# Altium schematic sheet Power_Supply.SchDoc (part 2 of 2)
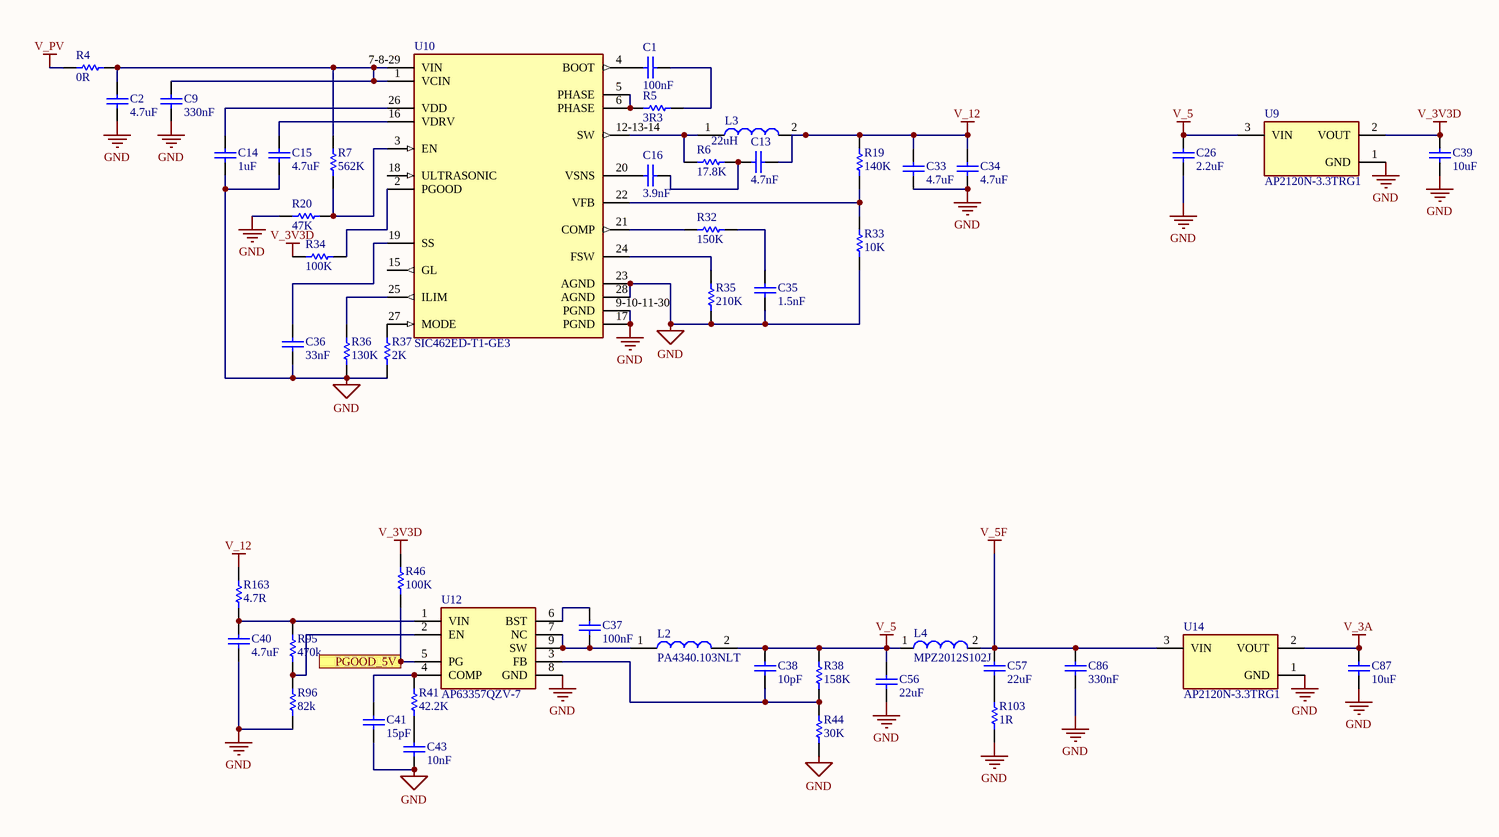
[diagram p1: Power_Supply.SchDoc]

## Library data of the parts (continued)
R20 = CMP-2000-00523-2: Chip Resistor, 47 KOhm, +/- 1%, 0.1 W, -55 to 155 degC, 0603 (1608 Metric), RoHS, Tape and Reel; Manufacturer: Panasonic; Manufacturer Part Number: ERJ3EKF4702V; Case\Package: 0603; Forward Current: 20 mA; Power Rating: 90 mW; Illumination Colour: Red; Nominal Vf: 2.1 V; Viewing Angle: 160 degrees; Luminous Intensity: 63 mcd; Lens Style: Clear; Nominal Wavelength: 639 nm; Resistance: 47kR; Max Power Dissipation: 100mW; Voltage Rating: 75V; Temperature Coefficient: 100ppm/°C; Working Voltage: 6V; Case Code (Imperial): 0603; Case Code (Metric): 1608; Packaging: Tape and Reel; Radiation Hardening: No; Colour: Red; PackageDescription: 2-Pin Surface Mount Device, Body 1.6 x 0.85 mm; ComponentLink1Description: Manufacturer URL; Width: 0.8 mm; DatasheetVersion: Apr-15; ComponentLink2URL: http://industrial.panasonic.com/cdbs/www-data/pdf/RDA0000/AOA0000C86.pdf; Min Operating Temperature: -40 degC; Height: 0.6 mm; Package Quantity: 3000; ComponentLink2Description: Datasheet; REACH SVHC: No SVHC; ComponentLink1URL: http://www.panasonic.com/; Mount: Surface Mount; RoHSCompliant: true; Max Operating Temperature: 100 degC; PackageReference: 0603; Length: 1.6 mm; Forward Voltage: 2.1 V; Pins: 2; Supplier 1: RSComponents; Supplier Part Number 1: 1755768; RoHS: Yes; Category: Chip SMD Resistors; Stock 1: 498000; Pricing 1: 5000=0.00700 (USD); Case/Package: 0603; Number of Pins: 2; Contact Plating: Tin; Tolerance: 1%; Termination: SMD/SMT; Resistor Type: Thick Film; Series: ERJ; Number of Terminations: 2; Resistance Tolerance: 1%; Voltage Rating (DC): 75V; Features: Automotive AEC-Q200; Construction: Rectangular; Technology: THICK FILM; Depth: 0.8mm; RoHS Compliant: Yes; Military Standard: Not; Lead Free: Lead Free; ComponentLink3URL: https://datasheet.ciiva.com/6138/aoa0000ce2-6138149.pdf?src-supplier=Farnell; ComponentLink3Description: https://datasheet.ciiva.com/6138/aoa0000ce2-6138149.pdf?src-supplier=Farnell; ComponentLink4URL: https://datasheet.ciiva.com/7802/aoa0000ce2-7802421.pdf?src-supplier=Element14; ComponentLink4Description: https://datasheet.ciiva.com/7802/aoa0000ce2-7802421.pdf?src-supplier=Element14; ComponentLink5URL: https://datasheet.ciiva.com/48531/aoa0000ce2-48531029.pdf?src-supplier=Avnet; ComponentLink5Description: https://datasheet.ciiva.com/48531/aoa0000ce2-48531029.pdf?src-supplier=Avnet; ComponentLink6URL: https://datasheet.ciiva.com/16514/aoa0000ce2-16514071.pdf?src-supplier=Avnet+Asia; ComponentLink6Description: https://datasheet.ciiva.com/16514/aoa0000ce2-16514071.pdf?src-supplier=Avnet+Asia; ComponentLink7URL: https://datasheet.ciiva.com/46398/1678782-46398088.pdf?src-supplier=Element14; ComponentLink7Description: https://datasheet.ciiva.com/46398/1678782-46398088.pdf?src-supplier=Element14; ComponentLink8URL: https://datasheet.ciiva.com/24069/aoa0000ce2-24069209.pdf?src-supplier=Mouser; ComponentLink8Description: https://datasheet.ciiva.com/24069/aoa0000ce2-24069209.pdf?src-supplier=Mouser; ComponentLink9URL: https://datasheet.ciiva.com/46398/1678782-46398089.pdf?src-supplier=Element14; ComponentLink9Description: https://datasheet.ciiva.com/46398/1678782-46398089.pdf?src-supplier=Element14; ComponentLink10URL: https://datasheet.ciiva.com/30236/aoa0000ce2-30236698.pdf?src-supplier=Onlinecomponents.com; ComponentLink10Description: https://datasheet.ciiva.com/30236/aoa0000ce2-30236698.pdf?src-supplier=Onlinecomponents.com; ComponentLink11URL: https://datasheet.ciiva.com/22722/426256-22722781.pdf?src-supplier=Element14; ComponentLink11Description: https://datasheet.ciiva.com/22722/426256-22722781.pdf?src-supplier=Element14; ComponentLink12URL: https://datasheet.ciiva.com/16758/70260748-16758831.pdf?src-supplier=Allied+Electronics; ComponentLink12Description: https://datasheet.ciiva.com/16758/70260748-16758831.pdf?src-supplier=Allied+Electronics
R32 = CMP-1011-00754-2: RES, THICK FILM, 150K, 1%, 0.1W, 0402; Manufacturer: Panasonic; Part Number: ERJ-2RKF1503X; Resistance: 150kR; Power Rating: 100mW; Temperature Coefficient: 100ppm/°C; Voltage Rating: 50V; Supplier 1: Newark; Supplier Part Number 1: 64R5260; Manufacturer Part Number: ERJ-2RKF1503X; RoHS: Yes; Category: Chip SMD Resistors; Stock 1: 75938; Pricing 1: 1=0.00300, 25=0.00300, 100=0.00300, 250=0.00300, 500=0.00300, 1000=0.00300, 2500=0.00300 (USD); Mount: Surface Mount; Case/Package: 0402; Number of Pins: 2; Case Code (Imperial): 0402; Case Code (Metric): 1005; Contact Plating: Tin; Weight: 2.8E-05oz; Size Code: 0402; Min Operating Temperature: -55°C; Max Operating Temperature: 155°C; Tolerance: 1%; Packaging: Tape and Reel; Max Power Dissipation: 100mW; Resistor Type: Thick Film; Number of Terminations: 2; Package Quantity: 1; Series: ERJ; Termination: SMD/SMT; Construction: Rectangular; Voltage Rating (DC): 50V; Features: Automotive AEC-Q200; Resistance Tolerance: 1%; Technology: THICK FILM; Length: 1mm; Width: 0.5mm; Height: 0.35mm; Depth: 0.5mm; Radiation Hardening: No; RoHS Compliant: Yes; Military Standard: Not; REACH SVHC: No SVHC; Lead Free: Lead Free; ComponentLink1URL: https://datasheet.ciiva.com/11821/0900766b80f80784-11821185.pdf?src-supplier=RSComponents; ComponentLink1Description: https://datasheet.ciiva.com/11821/0900766b80f80784-11821185.pdf?src-supplier=RSComponents; ComponentLink2URL: https://datasheet.ciiva.com/7909/426256-7909541.pdf?src-supplier=Element14; ComponentLink2Description: https://datasheet.ciiva.com/7909/426256-7909541.pdf?src-supplier=Element14; ComponentLink3URL: https://datasheet.ciiva.com/22673/1678782-22673269.pdf?src-supplier=Element14; ComponentLink3Description: https://datasheet.ciiva.com/22673/1678782-22673269.pdf?src-supplier=Element14; ComponentLink4URL: https://datasheet.ciiva.com/16768/70260748-16768198.pdf?src-supplier=Allied+Electronics; ComponentLink4Description: https://datasheet.ciiva.com/16768/70260748-16768198.pdf?src-supplier=Allied+Electronics; ComponentLink5URL: https://datasheet.ciiva.com/16426/aoa0000ce2-16426743.pdf?src-supplier=Future+Electronics; ComponentLink5Description: https://datasheet.ciiva.com/16426/aoa0000ce2-16426743.pdf?src-supplier=Future+Electronics; ComponentLink6URL: https://datasheet.ciiva.com/43467/1678782-43467495.pdf?src-supplier=Farnell; ComponentLink6Description: https://datasheet.ciiva.com/43467/1678782-43467495.pdf?src-supplier=Farnell; ComponentLink7URL: https://datasheet.ciiva.com/28547/1678782-28547178.pdf?src-supplier=Element14; ComponentLink7Description: https://datasheet.ciiva.com/28547/1678782-28547178.pdf?src-supplier=Element14; ComponentLink8URL: https://datasheet.ciiva.com/6137/aoa0000ce2-6137547.pdf?src-supplier=Farnell; ComponentLink8Description: https://datasheet.ciiva.com/6137/aoa0000ce2-6137547.pdf?src-supplier=Farnell; ComponentLink9URL: https://datasheet.ciiva.com/7909/aoa0000ce2-7909181.pdf?src-supplier=Element14; ComponentLink9Description: https://datasheet.ciiva.com/7909/aoa0000ce2-7909181.pdf?src-supplier=Element14
R33 = CMP-2000-07588-1: Chip Resistor, 10 KOhm, +/- 1%, 0.1 W, -55 to 155 degC, 0402 (1005 Metric), RoHS, Tape and Reel; Manufacturer: Panasonic; Manufacturer Part Number: ERJ-2RKF1002X; Power Rating: 100mW; Voltage Rating: 50V; Resistance: 10KOhm; Case\/Package: 0402; Temperature Coefficient: 100ppm\/degreesC; RoHSCompliant: True; Lead Free: LeadFree; Package Quantity: 1; Contact Plating: Tin; Length: 1mm; Radiation Hardening: No; REACH SVHC: NoSVHC; Max Operating Temperature: 155degC; Depth: 0.5mm; Case Code (Imperial): 0402; Military Standard: Not; Package Description: 2-Pin Surface Mount Device, Body 1 x 0.5 mm; Termination: SMD/SMT; Case Code (Metric): 1005; Height: 0.35mm; Packaging: TapeandReel; Voltage Rating (DC): 50V; Package Reference: 402; Number of Pins: 2; Tolerance: 1%; Mounting Technology: SurfaceMount; Width: 0.02inch; Mount: SurfaceMount; Datasheet URL: https://industrial.panasonic.com/cdbs/www-data/pdf/RDA0000/AOA0000C304.pdf; Composition: ThickFilm; Datasheet Version: 02/2017; Manufacturer URL: http://www.panasonic.com/; Max Power Dissipation: 100mW; Number of Terminations: 2; Min Operating Temperature: -55degC; Supplier 1: Newark; Supplier Part Number 1: 85Y8053; RoHS: Yes; Category: Chip SMD Resistors; Stock 1: 354481; Pricing 1: 10=0.02800, 25=0.02300 (USD); Case/Package: 0402; Resistor Type: Thick Film; Features: Automotive AEC-Q200; Height - Seated (Max): 0.016inch; RoHS Compliant: Yes; ComponentLink1URL: https://datasheet.ciiva.com/11821/0900766b80f80784-11821171.pdf?src-supplier=RSComponents; ComponentLink1Description: https://datasheet.ciiva.com/11821/0900766b80f80784-11821171.pdf?src-supplier=RSComponents; ComponentLink2URL: https://datasheet.ciiva.com/16199/aoa0000ce2-16199478.pdf?src-supplier=Future+Electronics; ComponentLink2Description: https://datasheet.ciiva.com/16199/aoa0000ce2-16199478.pdf?src-supplier=Future+Electronics; ComponentLink3URL: https://datasheet.ciiva.com/17212/aoa0000ce2-17212102.pdf?src-supplier=Avnet+Europe; ComponentLink3Description: https://datasheet.ciiva.com/17212/aoa0000ce2-17212102.pdf?src-supplier=Avnet+Europe; ComponentLink4URL: https://datasheet.ciiva.com/24023/aoa0000ce2-24023017.pdf?src-supplier=Mouser; ComponentLink4Description: https://datasheet.ciiva.com/24023/aoa0000ce2-24023017.pdf?src-supplier=Mouser; ComponentLink5URL: https://datasheet.ciiva.com/28514/1678782-28514185.pdf?src-supplier=Element14; ComponentLink5Description: https://datasheet.ciiva.com/28514/1678782-28514185.pdf?src-supplier=Element14; ComponentLink6URL: https://datasheet.ciiva.com/43467/1678782-43467402.pdf?src-supplier=Farnell; ComponentLink6Description: https://datasheet.ciiva.com/43467/1678782-43467402.pdf?src-supplier=Farnell; ComponentLink7URL: https://datasheet.ciiva.com/27055/1987020-27055643.pdf?src-supplier=Jameco; ComponentLink7Description: https://datasheet.ciiva.com/27055/1987020-27055643.pdf?src-supplier=Jameco; ComponentLink8URL: https://datasheet.ciiva.com/48531/aoa0000ce2-48531069.pdf?src-supplier=Avnet; ComponentLink8Description: https://datasheet.ciiva.com/48531/aoa0000ce2-48531069.pdf?src-supplier=Avnet; ComponentLink9URL: https://datasheet.ciiva.com/9194/aoa0000ce2-9194142.pdf?src-supplier=Avnet; ComponentLink9Description: https://datasheet.ciiva.com/9194/aoa0000ce2-9194142.pdf?src-supplier=Avnet; ComponentLink10URL: https://datasheet.ciiva.com/16782/70260748-16782590.pdf?src-supplier=Allied+Electronics; ComponentLink10Description: https://datasheet.ciiva.com/16782/70260748-16782590.pdf?src-supplier=Allied+Electronics; ComponentLink11URL: https://datasheet.ciiva.com/16786/70260748-16786734.pdf?src-supplier=Allied+Electronics; ComponentLink11Description: https://datasheet.ciiva.com/16786/70260748-16786734.pdf?src-supplier=Allied+Electronics; ComponentLink12URL: https://datasheet.ciiva.com/30201/aoa0000ce2-30201022.pdf?src-supplier=Onlinecomponents.com; ComponentLink12Description: https://datasheet.ciiva.com/30201/aoa0000ce2-30201022.pdf?src-supplier=Onlinecomponents.com
R34 R46 = CMP-2002-07343-1: Res General Purpose Thick Film 0402 100K Ohm 1% 1/16W ±100ppm/°C Molded SMD Paper T/R; Part Number: RC0402FR-07100KL; Manufacturer: Yageo / Phycomp; Power Rating: 63mW; Resistance: 100kR; Voltage Rating: 50V; Supplier 1: Digi-Key; Supplier Part Number 1: 311-100KLRCT-ND; Manufacturer Part Number: RC0402FR-07100KL; RoHS: Yes; Category: Chip SMD Resistors; Stock 1: 17727422; Pricing 1: 1=0.10000, 10=0.01600, 100=0.00640, 1000=0.00286, 2500=0.00248, 5000=0.00205 (USD); Case/Package: 0402; Case Code (Metric): 1005; Case Code (Imperial): 0402; Min Operating Temperature: -55°C; Max Operating Temperature: 155°C; Tolerance: 1%; Packaging: Tape and Reel; Max Power Dissipation: 63mW; Series: RC; Package Quantity: 1; Termination: SMD/SMT; Resistance Tolerance: 1%; Resistor Type: Thick Film; Number of Terminations: 2; Temperature Coefficient: 100ppm/°C; Construction: Rectangular; Features: Moisture Resistant; Technology: THICK FILM; Working Voltage: 50V; Length: 0.039inch; Width: 0.02inch; Height: 0.016inch; Depth: 0.5mm; RoHS Compliant: Yes; REACH SVHC: No SVHC; Military Standard: Not; Lead Free: Lead Free; ComponentLink1URL: https://datasheet.ciiva.com/11819/0900766b80c66297-11819452.pdf?src-supplier=RSComponents; ComponentLink1Description: https://datasheet.ciiva.com/11819/0900766b80c66297-11819452.pdf?src-supplier=RSComponents; ComponentLink2URL: https://datasheet.ciiva.com/2453/pyu-r-int-thick-7-2453361.pdf?src-supplier=Digi-Key; ComponentLink2Description: https://datasheet.ciiva.com/2453/pyu-r-int-thick-7-2453361.pdf?src-supplier=Digi-Key; ComponentLink3URL: https://datasheet.ciiva.com/2453/pyu-r-int-thick-7-2453362.pdf?src-supplier=Digi-Key; ComponentLink3Description: https://datasheet.ciiva.com/2453/pyu-r-int-thick-7-2453362.pdf?src-supplier=Digi-Key; ComponentLink4URL: https://datasheet.ciiva.com/2453/pyu-r-int-thick-7-2453363.pdf?src-supplier=Digi-Key; ComponentLink4Description: https://datasheet.ciiva.com/2453/pyu-r-int-thick-7-2453363.pdf?src-supplier=Digi-Key; ComponentLink5URL: https://datasheet.ciiva.com/22747/1018594-22747509.pdf?src-supplier=Element14; ComponentLink5Description: https://datasheet.ciiva.com/22747/1018594-22747509.pdf?src-supplier=Element14; ComponentLink6URL: https://datasheet.ciiva.com/15189/getdatasheetpartid-323696-15189334.pdf?src-supplier=Verical; ComponentLink6Description: https://datasheet.ciiva.com/15189/getdatasheetpartid-323696-15189334.pdf?src-supplier=Verical; ComponentLink7URL: https://datasheet.ciiva.com/12667/pyu-rc0402-51-rohs-l-6-r-12667930.pdf?src-supplier=Mouser; ComponentLink7Description: https://datasheet.ciiva.com/12667/pyu-rc0402-51-rohs-l-6-r-12667930.pdf?src-supplier=Mouser
R35 = CMP-2002-00770-1: SMD Chip Resistor, Thick Film, 210 kohm, 50 V, 0402 [1005 Metric], 100 mW,  1%, ERJ2R Series; Manufacturer: Panasonic; Part Number: ERJ-2RKF2103X; Resistance: 210kR; Temperature Coefficient: 100ppm/°C; Power Rating: 100mW; Voltage Rating: 50V; Supplier 1: Digi-Key; Supplier Part Number 1: P210KLCT-ND; Manufacturer Part Number: ERJ-2RKF2103X; RoHS: Yes; Category: Chip SMD Resistors; Stock 1: 45684; Pricing 1: 1=0.10000, 10=0.04400, 100=0.01780, 1000=0.00802, 2500=0.00696, 5000=0.00575 (USD); Mount: Surface Mount; Case/Package: 0402; Case Code (Metric): 1005; Case Code (Imperial): 0402; Contact Plating: Tin; Min Operating Temperature: -55°C; Max Operating Temperature: 155°C; Tolerance: 1%; Packaging: Tape and Reel; Resistor Type: Thick Film; Max Power Dissipation: 100mW; Series: ERJ; Number of Terminations: 2; Voltage Rating (DC): 50V; Package Quantity: 10000; Termination: SMD/SMT; Construction: Rectangular; Resistance Tolerance: 1%; Technology: THICK FILM; Length: 1mm; Width: 0.02inch; Height: 0.35mm; Depth: 0.5mm; RoHS Compliant: Yes; Lead Free: Lead Free; REACH SVHC: Yes; Military Standard: Not; ComponentLink1URL: https://datasheet.ciiva.com/7712/1678782-7712806.pdf?src-supplier=Element14; ComponentLink1Description: https://datasheet.ciiva.com/7712/1678782-7712806.pdf?src-supplier=Element14; ComponentLink2URL: https://datasheet.ciiva.com/16770/70260748-16770519.pdf?src-supplier=Allied+Electronics; ComponentLink2Description: https://datasheet.ciiva.com/16770/70260748-16770519.pdf?src-supplier=Allied+Electronics; ComponentLink3URL: https://datasheet.ciiva.com/46373/1678782-46373144.pdf?src-supplier=Element14; ComponentLink3Description: https://datasheet.ciiva.com/46373/1678782-46373144.pdf?src-supplier=Element14; ComponentLink4URL: https://datasheet.ciiva.com/28531/1694929-28531417.pdf?src-supplier=Element14; ComponentLink4Description: https://datasheet.ciiva.com/28531/1694929-28531417.pdf?src-supplier=Element14; ComponentLink5URL: https://datasheet.ciiva.com/46373/1678782-46373145.pdf?src-supplier=Element14; ComponentLink5Description: https://datasheet.ciiva.com/46373/1678782-46373145.pdf?src-supplier=Element14; ComponentLink6URL: https://datasheet.ciiva.com/22673/1678782-22673338.pdf?src-supplier=Element14; ComponentLink6Description: https://datasheet.ciiva.com/22673/1678782-22673338.pdf?src-supplier=Element14; ComponentLink7URL: https://datasheet.ciiva.com/24026/aoa0000ce2-24026251.pdf?src-supplier=Mouser; ComponentLink7Description: https://datasheet.ciiva.com/24026/aoa0000ce2-24026251.pdf?src-supplier=Mouser; ComponentLink8URL: https://datasheet.ciiva.com/30072/aoa0000ce2-30072110.pdf?src-supplier=Onlinecomponents.com; ComponentLink8Description: https://datasheet.ciiva.com/30072/aoa0000ce2-30072110.pdf?src-supplier=Onlinecomponents.com; ComponentLink9URL: https://datasheet.ciiva.com/9184/aoa0000ce2-9184527.pdf?src-supplier=Avnet; ComponentLink9Description: https://datasheet.ciiva.com/9184/aoa0000ce2-9184527.pdf?src-supplier=Avnet
R36 = CMP-2002-07381-1: Res Thick Film 1.0 x 0.5 mm 130K Ohm 1% 0.063W(1/16W) 100ppm/ C Molded SMD Paper T/R; Part Number: RC0402FR-07130KL; Manufacturer: Yageo / Phycomp; Resistance: 130kR; Temperature Coefficient: 100ppm/°C; Max Power Dissipation: 63mW; Power Rating: 62.5mW; Voltage Rating: 50V; Supplier 1: Digi-Key; Supplier Part Number 1: YAG2969CT-ND; Manufacturer Part Number: RC0402FR-07130KL; RoHS: Yes; Category: Chip SMD Resistors; Stock 1: 659496; Pricing 1: 1=0.10000, 10=0.01600, 100=0.00640, 1000=0.00286, 2500=0.00248, 5000=0.00205 (USD); Mount: Surface Mount; Case/Package: 0402; Case Code (Imperial): 0402; Case Code (Metric): 1005; Min Operating Temperature: -55°C; Max Operating Temperature: 155°C; Tolerance: 1%; Packaging: Tape and Reel; Resistor Type: Thick Film; Number of Terminations: 2; Series: RC; Voltage Rating (DC): 50V; Construction: Rectangular; Termination: SMD/SMT; Features: Moisture Resistant; Technology: THICK FILM; Working Voltage: 50V; Length: 1mm; Width: 0.02inch; Height: 0.016inch; Depth: 0.5mm; RoHS Compliant: Yes; Military Standard: Not; Lead Free: Lead Free; ComponentLink1URL: https://datasheet.ciiva.com/11808/0900766b80c66297-11808424.pdf?src-supplier=RSComponents; ComponentLink1Description: https://datasheet.ciiva.com/11808/0900766b80c66297-11808424.pdf?src-supplier=RSComponents; ComponentLink2URL: https://datasheet.ciiva.com/5562/pyu-rc0402-51-rohs-l-6-r-5562533.pdf?src-supplier=Mouser; ComponentLink2Description: https://datasheet.ciiva.com/5562/pyu-rc0402-51-rohs-l-6-r-5562533.pdf?src-supplier=Mouser; ComponentLink3URL: https://datasheet.ciiva.com/15189/getdatasheetpartid-410466-15189350.pdf?src-supplier=Verical; ComponentLink3Description: https://datasheet.ciiva.com/15189/getdatasheetpartid-410466-15189350.pdf?src-supplier=Verical; ComponentLink4URL: https://datasheet.ciiva.com/16742/pyu-rc0402-51-rohs-l-6-r-16742777.pdf?src-supplier=Future+Electronics; ComponentLink4Description: https://datasheet.ciiva.com/16742/pyu-rc0402-51-rohs-l-6-r-16742777.pdf?src-supplier=Future+Electronics
R37 = CMP-2002-00758-3: Chip Resistor, 2 KOhm, +/- 1%, 100 mW, -55 to 155 degC, 0402 (1005 Metric), RoHS, Tape and Reel; Manufacturer: Basic Passives; PartNumber: ERJ-2RKF2001X; Power Rating: 100 mW; Voltage Rating: 50 V; Case\/Package: 0402; Resistance: 2 KOhm; Max Power Dissipation: 100mW; Temperature Coefficient: 100ppm/°C; Voltage Rating (DC): 50V; Packaging: Tape and Reel; Tolerance: 1%; PackageReference: 0402; Package Quantity: 10000; ComponentLink1URL: http://www.panasonic.com/; Min Operating Temperature: -55 degC; DatasheetVersion: 04/2015; Case Code (Imperial): 0402; PackageDescription: 2-Pin Surface Mount Device, Body 1 x 0.5 mm; Height: 0.35 mm; Pins: 2; Mount: Surface Mount; Radiation Hardening: No; ComponentLink1Description: Manufacturer URL; ComponentLink2Description: Datasheet; Max Operating Temperature: 155 degC; Case Code (Metric): 1005; Length: 1 mm; RoHSCompliant: true; Mounting Technology: Surface Mount; Width: 0.5 mm; ComponentLink2URL: http://industrial.panasonic.com/cdbs/www-data/pdf/RDA0000/AOA0000C86.pdf; REACH SVHC: Unknown; Supplier 1: Digi-Key; Supplier Part Number 1: P2.00KLCT-ND; Manufacturer Part Number: ERJ-2RKF2001X; RoHS: Yes; Category: Chip SMD Resistors; Stock 1: 286903; Pricing 1: 1=0.10000, 10=0.02400, 100=0.00970, 1000=0.00437, 2500=0.00380, 5000=0.00314 (USD); Case/Package: 0402; Contact Plating: Tin; Termination: SMD/SMT; Resistor Type: Thick Film; Number of Terminations: 2; Series: ERJ; Features: Automotive AEC-Q200; Resistance Tolerance: 1%; Construction: Rectangular; Technology: THICK FILM; Working Voltage: 50V; Depth: 0.5mm; RoHS Compliant: Yes; Military Standard: Not; Lead Free: Lead Free; ComponentLink3URL: https://datasheet.ciiva.com/11821/0900766b80f80784-11821275.pdf?src-supplier=RSComponents; ComponentLink3Description: https://datasheet.ciiva.com/11821/0900766b80f80784-11821275.pdf?src-supplier=RSComponents; ComponentLink4URL: https://datasheet.ciiva.com/28673/1678782-28673989.pdf?src-supplier=Element14; ComponentLink4Description: https://datasheet.ciiva.com/28673/1678782-28673989.pdf?src-supplier=Element14; ComponentLink5URL: https://datasheet.ciiva.com/48531/aoa0000ce2-48531062.pdf?src-supplier=Avnet; ComponentLink5Description: https://datasheet.ciiva.com/48531/aoa0000ce2-48531062.pdf?src-supplier=Avnet; ComponentLink6URL: https://datasheet.ciiva.com/16199/aoa0000ce2-16199479.pdf?src-supplier=Future+Electronics; ComponentLink6Description: https://datasheet.ciiva.com/16199/aoa0000ce2-16199479.pdf?src-supplier=Future+Electronics; ComponentLink7URL: https://datasheet.ciiva.com/43460/426256-43460297.pdf?src-supplier=Farnell; ComponentLink7Description: https://datasheet.ciiva.com/43460/426256-43460297.pdf?src-supplier=Farnell; ComponentLink8URL: https://datasheet.ciiva.com/46377/426256-46377369.pdf?src-supplier=Element14; ComponentLink8Description: https://datasheet.ciiva.com/46377/426256-46377369.pdf?src-supplier=Element14; ComponentLink9URL: https://datasheet.ciiva.com/16514/aoa0000ce2-16514266.pdf?src-supplier=Avnet+Asia; ComponentLink9Description: https://datasheet.ciiva.com/16514/aoa0000ce2-16514266.pdf?src-supplier=Avnet+Asia; ComponentLink10URL: https://datasheet.ciiva.com/16785/70260748-16785818.pdf?src-supplier=Allied+Electronics; ComponentLink10Description: https://datasheet.ciiva.com/16785/70260748-16785818.pdf?src-supplier=Allied+Electronics; ComponentLink11URL: https://datasheet.ciiva.com/24070/aoa0000ce2-24070698.pdf?src-supplier=Mouser; ComponentLink11Description: https://datasheet.ciiva.com/24070/aoa0000ce2-24070698.pdf?src-supplier=Mouser; ComponentLink12URL: https://datasheet.ciiva.com/30247/aoa0000ce2-30247148.pdf?src-supplier=Onlinecomponents.com; ComponentLink12Description: https://datasheet.ciiva.com/30247/aoa0000ce2-30247148.pdf?src-supplier=Onlinecomponents.com; ComponentLink13URL: https://datasheet.ciiva.com/16760/70260748-16760013.pdf?src-supplier=Allied+Electronics; ComponentLink13Description: https://datasheet.ciiva.com/16760/70260748-16760013.pdf?src-supplier=Allied+Electronics; ComponentLink14URL: https://datasheet.ciiva.com/9197/aoa0000ce2-9197503.pdf?src-supplier=Avnet; ComponentLink14Description: https://datasheet.ciiva.com/9197/aoa0000ce2-9197503.pdf?src-supplier=Avnet; ComponentLink15URL: https://datasheet.ciiva.com/46389/426256-46389071.pdf?src-supplier=Element14; ComponentLink15Description: https://datasheet.ciiva.com/46389/426256-46389071.pdf?src-supplier=Element14
R38 = CMP-2002-00386-1: RES SMD 158K OHM 1% 1/16W 0402; Manufacturer: Vishay Dale; Part Number: CRCW0402158KFKTD; Resistance: 158kR; Temperature Coefficient: 100ppm/°C; Power Rating: 63mW; Voltage Rating: 50V; Supplier 1: Avnet; Supplier Part Number 1: CRCW0402158KFKTD; Manufacturer Part Number: CRCW0402158KFKTD; RoHS: No; Category: Chip SMD Resistors; Stock 1: 10000; Pricing 1: 10000=0.02620, 20000=0.02556, 40000=0.02520, 60000=0.02448, 80000=0.02394, 100000=0.02340, 1000000=0.02286 (USD); Case/Package: 0402; Number of Pins: 2; Case Code (Metric): 1005; Case Code (Imperial): 0402; Contact Plating: Tin,Lead; Weight: 2.3E-05oz; Min Operating Temperature: -55°C; Max Operating Temperature: 155°C; Packaging: Tape and Reel; Tolerance: 1%; Resistor Type: Thick Film; Package Quantity: 10000; Number of Terminations: 2; Termination: SMD/SMT; Max Power Dissipation: 63mW; Series: CRCW; Voltage Rating (DC): 50V; Features: Automotive AEC-Q200; Resistance Tolerance: 1%; Length: 0.039inch; Width: 0.02inch; Height: 0.016inch; Radiation Hardening: No; RoHS Compliant: No; Lead Free: Contains Lead; REACH SVHC: Unknown; ComponentLink1URL: https://datasheet.ciiva.com/8967/dcrcw-8967692.pdf?src-supplier=Avnet; ComponentLink1Description: https://datasheet.ciiva.com/8967/dcrcw-8967692.pdf?src-supplier=Avnet; ComponentLink2URL: https://datasheet.ciiva.com/2563/dcrcw-2563087.pdf?src-supplier=Digi-Key; ComponentLink2Description: https://datasheet.ciiva.com/2563/dcrcw-2563087.pdf?src-supplier=Digi-Key
R41 = CMP-2002-08626-1: Surface Mount Chip Resistor, Thick Film, AEC-Q200 CRCW Series, 42.2 kohm, 63 mW,  1%, 50 V; Part Number: CRCW040242K2FKED; Manufacturer: Vishay Dale; Resistance: 42.2kR; Temperature Coefficient: 100ppm/°C; Power Rating: 63mW; Voltage Rating: 50V; Supplier 1: Newark; Supplier Part Number 1: 52K7062; Manufacturer Part Number: CRCW040242K2FKED; RoHS: Yes; Category: Chip SMD Resistors; Stock 1: 19822; Pricing 1: 1=0.00500, 25=0.00500, 100=0.00500, 250=0.00500, 500=0.00500, 1000=0.00400 (USD); Case/Package: 0402; Number of Pins: 2; Case Code (Metric): 1005; Case Code (Imperial): 0402; Contact Plating: Tin; Weight: 2.3E-05oz; Size Code: 0402; Min Operating Temperature: -55°C; Max Operating Temperature: 155°C; Packaging: Tape and Reel; Tolerance: 1%; Resistor Type: Thick Film; Voltage Rating (DC): 50V; Series: CRCW; Number of Terminations: 2; Max Power Dissipation: 63mW; Package Quantity: 10; Termination: SMD/SMT; Features: Automotive AEC-Q200; Construction: Rectangular; Resistance Tolerance: 1%; Technology: THICK FILM; Length: 1mm; Width: 0.02inch; Height: 0.35mm; Depth: 0.5mm; Radiation Hardening: No; RoHS Compliant: Yes; Lead Free: Lead Free; REACH SVHC: Unknown; Military Standard: Not; ComponentLink1URL: https://datasheet.ciiva.com/3882/41397335s9853079n6892-3882805.pdf?src-supplier=Arrow+Electronics; ComponentLink1Description: https://datasheet.ciiva.com/3882/41397335s9853079n6892-3882805.pdf?src-supplier=Arrow+Electronics; ComponentLink2URL: https://datasheet.ciiva.com/11818/0900766b80d98824-11818095.pdf?src-supplier=RSComponents; ComponentLink2Description: https://datasheet.ciiva.com/11818/0900766b80d98824-11818095.pdf?src-supplier=RSComponents; ComponentLink3URL: https://datasheet.ciiva.com/2494/dcrcwe3-2494976.pdf?src-supplier=Digi-Key; ComponentLink3Description: https://datasheet.ciiva.com/2494/dcrcwe3-2494976.pdf?src-supplier=Digi-Key; ComponentLink4URL: https://datasheet.ciiva.com/2494/dcrcwe3-2494977.pdf?src-supplier=Digi-Key; ComponentLink4Description: https://datasheet.ciiva.com/2494/dcrcwe3-2494977.pdf?src-supplier=Digi-Key; ComponentLink5URL: https://datasheet.ciiva.com/3256/dcrcwe3-3256517.pdf?src-supplier=Avnet; ComponentLink5Description: https://datasheet.ciiva.com/3256/dcrcwe3-3256517.pdf?src-supplier=Avnet; ComponentLink6URL: https://datasheet.ciiva.com/16763/70201119-16763237.pdf?src-supplier=Allied+Electronics; ComponentLink6Description: https://datasheet.ciiva.com/16763/70201119-16763237.pdf?src-supplier=Allied+Electronics; ComponentLink7URL: https://datasheet.ciiva.com/8336/dcrcwe3-8336730.pdf?src-supplier=Avnet; ComponentLink7Description: https://datasheet.ciiva.com/8336/dcrcwe3-8336730.pdf?src-supplier=Avnet; ComponentLink8URL: https://datasheet.ciiva.com/7743/125364-7743643.pdf?src-supplier=Element14; ComponentLink8Description: https://datasheet.ciiva.com/7743/125364-7743643.pdf?src-supplier=Element14; ComponentLink9URL: https://datasheet.ciiva.com/2494/dcrcwe3-2494975.pdf?src-supplier=Digi-Key; ComponentLink9Description: https://datasheet.ciiva.com/2494/dcrcwe3-2494975.pdf?src-supplier=Digi-Key; ComponentLink10URL: https://datasheet.ciiva.com/7671/1697337-7671599.pdf?src-supplier=Element14; ComponentLink10Description: https://datasheet.ciiva.com/7671/1697337-7671599.pdf?src-supplier=Element14; ComponentLink11URL: https://datasheet.ciiva.com/22702/1697337-22702879.pdf?src-supplier=Element14; ComponentLink11Description: https://datasheet.ciiva.com/22702/1697337-22702879.pdf?src-supplier=Element14
R44 = CMP-1011-00675-2: Res Thick Film 0402 30K Ohm 1% 0.063W(1/16W) ±100ppm/C Molded SMD Automotive Paper T/R; Part Number: CRCW040230K0FKED; Manufacturer: Vishay Dale; Resistance: 30kR; Power Rating: 63mW; Temperature Coefficient: 100ppm/°C; Voltage Rating: 50V; Supplier 1: RSComponents; Supplier Part Number 1: 6789140; Manufacturer Part Number: CRCW040230K0FKED; RoHS: Yes; Category: Chip SMD Resistors; Stock 1: 19350; Pricing 1: 50=0.04000, 500=0.01600, 1250=0.00800 (USD); Mount: Surface Mount; Case/Package: 0402; Number of Pins: 2; Case Code (Imperial): 0402; Case Code (Metric): 1005; Weight: 2.3E-05oz; Contact Plating: Tin; Size Code: 0402; Min Operating Temperature: -55°C; Max Operating Temperature: 155°C; Tolerance: 1%; Packaging: Tape and Reel; Resistor Type: Thick Film; Number of Terminations: 2; Series: CRCW; Max Power Dissipation: 63mW; Voltage Rating (DC): 50V; Package Quantity: 10000; Termination: SMD/SMT; Construction: Rectangular; Resistance Tolerance: 1%; Features: Automotive AEC-Q200; Technology: THICK FILM; Length: 1mm; Width: 0.5mm; Height: 0.35mm; Depth: 0.5mm; Radiation Hardening: No; RoHS Compliant: Yes; Military Standard: Not; Lead Free: Lead Free; REACH SVHC: Unknown; ComponentLink1URL: https://datasheet.ciiva.com/11811/0900766b80d98824-11811264.pdf?src-supplier=RSComponents; ComponentLink1Description: https://datasheet.ciiva.com/11811/0900766b80d98824-11811264.pdf?src-supplier=RSComponents; ComponentLink2URL: https://datasheet.ciiva.com/7673/1697337-7673253.pdf?src-supplier=Element14; ComponentLink2Description: https://datasheet.ciiva.com/7673/1697337-7673253.pdf?src-supplier=Element14; ComponentLink3URL: https://datasheet.ciiva.com/2464/dcrcwe3-2464534.pdf?src-supplier=Digi-Key; ComponentLink3Description: https://datasheet.ciiva.com/2464/dcrcwe3-2464534.pdf?src-supplier=Digi-Key; ComponentLink4URL: https://datasheet.ciiva.com/7673/1697337-7673254.pdf?src-supplier=Element14; ComponentLink4Description: https://datasheet.ciiva.com/7673/1697337-7673254.pdf?src-supplier=Element14; ComponentLink5URL: https://datasheet.ciiva.com/2464/dcrcwe3-2464535.pdf?src-supplier=Digi-Key; ComponentLink5Description: https://datasheet.ciiva.com/2464/dcrcwe3-2464535.pdf?src-supplier=Digi-Key; ComponentLink6URL: https://datasheet.ciiva.com/2464/dcrcwe3-2464536.pdf?src-supplier=Digi-Key; ComponentLink6Description: https://datasheet.ciiva.com/2464/dcrcwe3-2464536.pdf?src-supplier=Digi-Key; ComponentLink7URL: https://datasheet.ciiva.com/16886/dcrcwe3-16886248.pdf?src-supplier=Avnet+Europe; ComponentLink7Description: https://datasheet.ciiva.com/16886/dcrcwe3-16886248.pdf?src-supplier=Avnet+Europe; ComponentLink8URL: https://datasheet.ciiva.com/3256/dcrcwe3-3256380.pdf?src-supplier=Avnet; ComponentLink8Description: https://datasheet.ciiva.com/3256/dcrcwe3-3256380.pdf?src-supplier=Avnet; ComponentLink9URL: https://datasheet.ciiva.com/22702/1697337-22702876.pdf?src-supplier=Element14; ComponentLink9Description: https://datasheet.ciiva.com/22702/1697337-22702876.pdf?src-supplier=Element14; ComponentLink10URL: https://datasheet.ciiva.com/16784/70201119-16784286.pdf?src-supplier=Allied+Electronics; ComponentLink10Description: https://datasheet.ciiva.com/16784/70201119-16784286.pdf?src-supplier=Allied+Electronics
R95 R96 = CMP-2002-00968-1: ERJ-2RKF4993X; Manufacturer: Panasonic; Tolerance: 1%; Resistance: 499kR; Temperature Coefficient: 100ppm/°C; Power Rating: 100mW; Voltage Rating: 50V; Part Number: ERJ-2RKF4993X; Supplier 1: Digi-Key; Supplier Part Number 1: P499KLCT-ND; Manufacturer Part Number: ERJ-2RKF4993X; RoHS: Yes; Category: Chip SMD Resistors; Stock 1: 131008; Pricing 1: 1=0.10000, 10=0.04000, 100=0.01620, 1000=0.00729, 2500=0.00632, 5000=0.00523 (USD); Mount: Surface Mount; Case/Package: 0402; Weight: 2.8E-05oz; Case Code (Imperial): 0402; Case Code (Metric): 1005; Contact Plating: Tin; Min Operating Temperature: -55°C; Max Operating Temperature: 155°C; Packaging: Tape and Reel; Composition: Thick Film; Package Quantity: 1; Termination: SMD/SMT; Number of Terminations: 2; Max Power Dissipation: 100mW; Voltage Rating (DC): 50V; Features: Automotive AEC-Q200; Military Standard: Not; Length: 1mm; Height: 0.016inch; Width: 0.5mm; Depth: 0.5mm; Lead Free: Lead Free; REACH SVHC: Unknown; ComponentLink1URL: https://datasheet.ciiva.com/28610/1678782-28610966.pdf?src-supplier=Element14; ComponentLink1Description: https://datasheet.ciiva.com/28610/1678782-28610966.pdf?src-supplier=Element14; ComponentLink2URL: https://datasheet.ciiva.com/24163/aoa0000ce2-24163576.pdf?src-supplier=Mouser; ComponentLink2Description: https://datasheet.ciiva.com/24163/aoa0000ce2-24163576.pdf?src-supplier=Mouser; ComponentLink3URL: https://datasheet.ciiva.com/9181/aoa0000ce2-9181513.pdf?src-supplier=Avnet; ComponentLink3Description: https://datasheet.ciiva.com/9181/aoa0000ce2-9181513.pdf?src-supplier=Avnet; ComponentLink4URL: https://datasheet.ciiva.com/5951/426256-5951322.pdf?src-supplier=Farnell; ComponentLink4Description: https://datasheet.ciiva.com/5951/426256-5951322.pdf?src-supplier=Farnell; ComponentLink5URL: https://datasheet.ciiva.com/43460/426256-43460346.pdf?src-supplier=Farnell; ComponentLink5Description: https://datasheet.ciiva.com/43460/426256-43460346.pdf?src-supplier=Farnell; ComponentLink6URL: https://datasheet.ciiva.com/9181/aoa0000ce2-9181509.pdf?src-supplier=Avnet; ComponentLink6Description: https://datasheet.ciiva.com/9181/aoa0000ce2-9181509.pdf?src-supplier=Avnet; ComponentLink7URL: https://datasheet.ciiva.com/28672/1678782-28672345.pdf?src-supplier=Element14; ComponentLink7Description: https://datasheet.ciiva.com/28672/1678782-28672345.pdf?src-supplier=Element14; ComponentLink8URL: https://datasheet.ciiva.com/46377/426256-46377753.pdf?src-supplier=Element14; ComponentLink8Description: https://datasheet.ciiva.com/46377/426256-46377753.pdf?src-supplier=Element14; ComponentLink9URL: https://datasheet.ciiva.com/16760/70260748-16760715.pdf?src-supplier=Allied+Electronics; ComponentLink9Description: https://datasheet.ciiva.com/16760/70260748-16760715.pdf?src-supplier=Allied+Electronics
R103 = RES-2: Chip Resistor, 0 Ohm, +/- 5%, 125 mW, -55 to 155 degC, 0805 (2012 Metric), RoHS, Tape and Reel; PartNumber: ERJ-6GEY0R00V; Manufacturer: Basic Passives; Power Rating: 125 mW; Case\/Package: 0805; Resistance: 0 Ohm; Voltage Rating: 150 V; Pins: 2; Mount: Surface Mount; ComponentLink2URL: http://industrial.panasonic.com/cdbs/www-data/pdf/RDA0000/AOA0000C84.pdf; Height: 0.6 mm; Max Operating Temperature: 155 degC; PackageDescription: 2-Pin Surface Mount Device, Body 2 x 1.25 mm; Min Operating Temperature: -55 degC; Width: 1.25 mm; Case Code (Metric): 2012; Radiation Hardening: No; PackageReference: 0805; ComponentLink2Description: Datasheet; Package Quantity: 5000; Packaging: Tape and Reel; ComponentLink1Description: Manufacturer URL; DatasheetVersion: 03/2015; Tolerance: 5%; RoHSCompliant: true; Mounting Technology: Surface Mount; Length: 2 mm; Case Code (Imperial): 0805; REACH SVHC: No SVHC; ComponentLink1URL: http://www.panasonic.com/
R163 = CMP-1665-00033-1: Chip Resistor, 4.7 Ohm, +/- 1%, 125 mW, -55 to 125 degC, 0805 (2012 Metric), RoHS, Tape and Reel; PartNumber: ERJ-6RQF4R7V; Manufacturer: Panasonic; Power Rating: 125 mW; Case\/Package: 0805; Resistance: 4.7 Ohm; Temperature Coefficient: 200ppm/°C; Max Power Dissipation: 125mW; Mount: Surface Mount; Length: 0.079 inch; Tolerance: 1%; REACH SVHC: No SVHC; PackageDescription: 2-Pin Surface Mount Device, Body 2 x 1.5 mm; ComponentLink1URL: http://www.panasonic.com/; Width: 0.049 inch; Min Operating Temperature: -55 degC; Height: 0.028 inch; Case Code (Metric): 2012; Mounting Technology: Surface Mount; Pins: 2; Max Operating Temperature: 125 degC; Packaging: Tape and Reel; ComponentLink2URL: http://industrial.panasonic.com/cdbs/www-data/pdf/RDA0000/AOA0000C86.pdf; RoHSCompliant: true; ComponentLink2Description: Datasheet; PackageReference: 0805; Package Quantity: 5000; ComponentLink1Description: Manufacturer URL; Radiation Hardening: No; Case Code (Imperial): 0805; DatasheetVersion: 04/2015; Supplier 1: Digi-Key; Supplier Part Number 1: P4.7DCT-ND; Manufacturer Part Number: ERJ-6RQF4R7V; RoHS: Yes; Category: Chip SMD Resistors; Stock 1: 7470; Pricing 1: 1=0.37000, 10=0.31100, 25=0.22640, 50=0.16420, 100=0.12170, 250=0.09340, 500=0.07358, 1000=0.05094 (USD); Case/Package: 0805; Number of Pins: 2; Contact Plating: Tin; Composition: Thick Film; Number of Terminations: 2; Termination: SMD/SMT; Military Standard: Not; Depth: 1.25mm; Lead Free: Lead Free; ComponentLink3URL: https://datasheet.ciiva.com/11818/0900766b80eefa12-11818492.pdf?src-supplier=RSComponents; ComponentLink3Description: https://datasheet.ciiva.com/11818/0900766b80eefa12-11818492.pdf?src-supplier=RSComponents; ComponentLink4URL: https://datasheet.ciiva.com/25711/391509-25711737.pdf?src-supplier=Farnell; ComponentLink4Description: https://datasheet.ciiva.com/25711/391509-25711737.pdf?src-supplier=Farnell; ComponentLink5URL: https://datasheet.ciiva.com/17213/aoa0000ce3-17213115.pdf?src-supplier=Avnet+Europe; ComponentLink5Description: https://datasheet.ciiva.com/17213/aoa0000ce3-17213115.pdf?src-supplier=Avnet+Europe; ComponentLink6URL: https://datasheet.ciiva.com/22746/391509-22746507.pdf?src-supplier=Element14; ComponentLink6Description: https://datasheet.ciiva.com/22746/391509-22746507.pdf?src-supplier=Element14; ComponentLink7URL: https://datasheet.ciiva.com/9195/aoa0000ce3-9195709.pdf?src-supplier=Avnet; ComponentLink7Description: https://datasheet.ciiva.com/9195/aoa0000ce3-9195709.pdf?src-supplier=Avnet; ComponentLink8URL: https://datasheet.ciiva.com/16761/70068852-16761070.pdf?src-supplier=Allied+Electronics; ComponentLink8Description: https://datasheet.ciiva.com/16761/70068852-16761070.pdf?src-supplier=Allied+Electronics; ComponentLink9URL: https://datasheet.ciiva.com/22730/391509-22730382.pdf?src-supplier=Element14; ComponentLink9Description: https://datasheet.ciiva.com/22730/391509-22730382.pdf?src-supplier=Element14; ComponentLink10URL: https://datasheet.ciiva.com/24026/aoa0000ce3-72189-24026846.pdf?src-supplier=Mouser; ComponentLink10Description: https://datasheet.ciiva.com/24026/aoa0000ce3-72189-24026846.pdf?src-supplier=Mouser; ComponentLink11URL: https://datasheet.ciiva.com/30074/6aoa0000ce3-30074670.pdf?src-supplier=Onlinecomponents.com; ComponentLink11Description: https://datasheet.ciiva.com/30074/6aoa0000ce3-30074670.pdf?src-supplier=Onlinecomponents.com
U9 U14 = CMP-12756-000008-1: IC REG LINEAR 3.3V 150MA SOT23; Manufacturer: Diodes Inc.; Min Supply Voltage: 2V; Standoff Height: 0.013mm; Max Junction Temp: +85°C; Output Type: Fixed; Max Supply Voltage: 6V; Accuracy Percentage: 2%; Nominal Supply Current: 25uA; Dropout Voltage: 300mV; Number Of Outputs: 1; Output Voltage: 3.3V; Footprint Url: https://www.diodes.com/assets/Package-Files/SOT23.pdf; Category: IC; Manufacturer Part Number: AP2120N-3.3TRG1; ComponentLink2Description: Datasheet; Device Class L1: Integrated Circuits (ICs); Octopart: https://octopart.com/ap2120n-3.3trg1-diodes+inc.-30954573; Temperature Range Low: -40°C; Temperature: -40°C to +85°C; Temperature Range High: +85°C; Package: SOT23; Digikey Description: IC REG LINEAR 3.3V 150MA SOT23; Height: 1.1mm; Mouser Description: AP2120 Series 3.3 V 0.15 A Surface Mount CMOS LDO Regulator - SOT23; RoHS: TRUE; ComponentLink2URL: https://www.diodes.com/assets/Package-Files/SOT23.pdf; Device Class L2: Power Management ICs; Device Class L3: Voltage Regulators - Linear; Output Current: 150mA; Ipc Land Pattern Name: SOT92P240X102-3; Lead Free: Yes; Automotive: No
U10 = CMP-02506-000001-1: IC REG BUCK ADJ 6A MLP55-27; Manufacturer: Vishay; Output Voltage: 0.8-55.2V; Output Type: AdjustableProgrammable; Standoff Height: 0mm; Number Of Outputs: 1; Nominal Supply Current: 235uA; Min Supply Voltage: 4.5V; Max Junction Temp: +125°C; Max Supply Voltage: 60V; Switching Frequency: 100-2000kHz; Category: IC; RoHS: TRUE; Switching Topology: Buck; Temperature: -40°C to +125°C; Temperature Range Low: -40°C; ComponentLink2Description: Datasheet; Lead Free: Yes; ComponentLink2URL: https://www.vishay.com/docs/65124/sic46x.pdf; Ambient Temperature Range High: +105°C; Device Class L3: Voltage Regulators - Switching; Height: 0.8mm; Manufacturer Part Number: SIC462ED-T1-GE3; Temperature Range High: +125°C; Mouser Description: SiC462 Series 60 V 6 A Synchronous Buck Regulator - PowerPAK® MLP55-27; Digikey Description: IC REG BUCK ADJ 6A MLP55-27; Device Class L2: Power Management ICs; Output Current: 6A; Package: T18-0594; Automotive: No; Device Class L1: Integrated Circuits (ICs); Octopart: https://octopart.com/sic462ed-t1-ge3-vishay-76790763; Ambient Temperature Range Low: -40°C
U12 = AP63357QZV-7: Integrated Circuit; Manufacturer_Name: Diodes Inc.; Datasheet Link: https://www.diodes.com/assets/Datasheets/AP63356Q_AP63357Q.pdf; Height: 0.85mm; Manufacturer_Part_Number: AP63357QZV-7; Mouser Part Number: 621-AP63357QZV-7; Mouser Price/Stock: https://www.mouser.co.uk/ProductDetail/Diodes-Incorporated/AP63357QZV-7?qs=DPoM0jnrROUeS%2FU8ZrDy%2FA%3D%3D